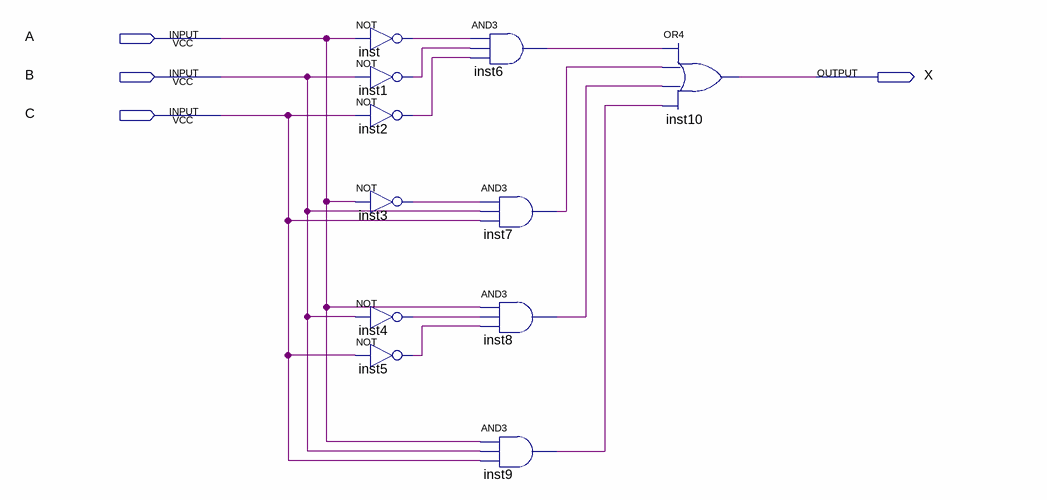
[diagram p0: schematic sheet]
// Quartus schematic circuito.bdf as structural Verilog: 11 symbols, 4 pins
module circuito (
  input  A,
  input  B,
  input  C,
  output X
);

  wire inst1_out, inst2_out, inst3_out, inst4_out, inst5_out, inst6_out, inst7_out, inst8_out, inst9_out,
       inst_out;

  not inst (inst_out, A);
  not inst1 (inst1_out, B);
  not inst2 (inst2_out, C);
  not inst3 (inst3_out, A);
  not inst4 (inst4_out, B);
  not inst5 (inst5_out, C);
  and inst6 (inst6_out, inst_out, inst1_out, inst2_out);
  and inst7 (inst7_out, inst3_out, B, C);
  and inst8 (inst8_out, A, inst4_out, inst5_out);
  and inst9 (inst9_out, A, B, C);
  or inst10 (X, inst6_out, inst7_out, inst8_out, inst9_out);
endmodule
